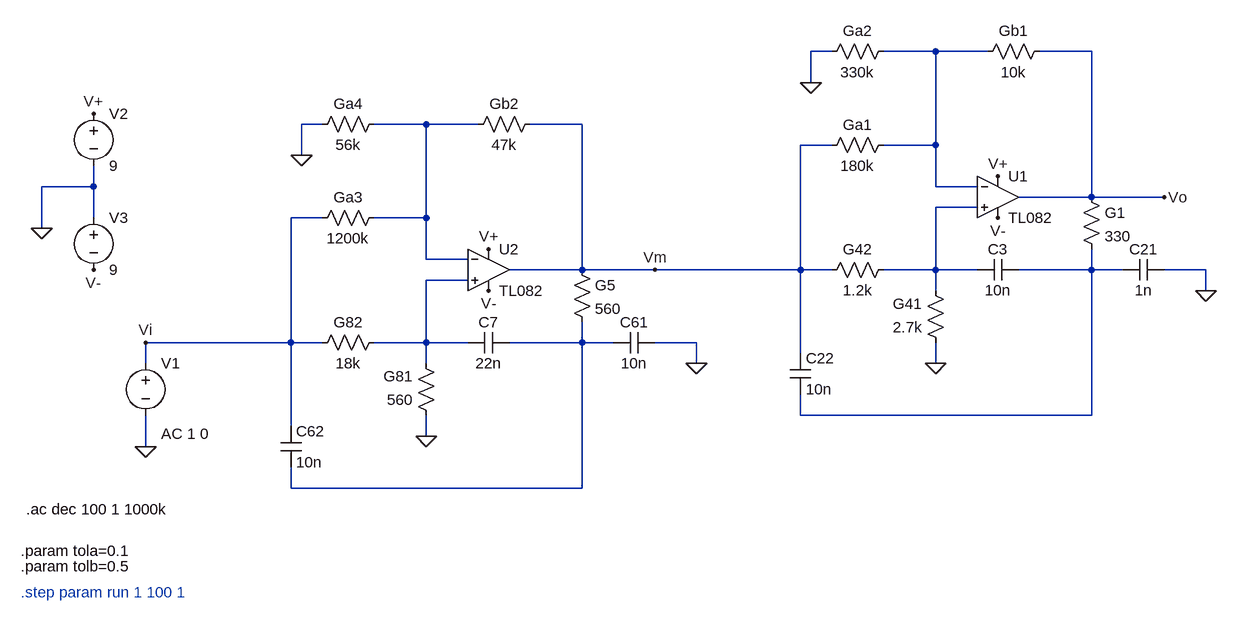
[diagram p0: schematic Sedra.asc]
Sedra.asc, the LTspice schematic file:
Version 4
SHEET 1 3604 680
WIRE 3008 -352 2976 -352
WIRE 3168 -352 3088 -352
WIRE 3248 -352 3168 -352
WIRE 3408 -352 3328 -352
WIRE 2976 -304 2976 -352
WIRE 2224 -240 2192 -240
WIRE 2384 -240 2304 -240
WIRE 2464 -240 2384 -240
WIRE 2624 -240 2544 -240
WIRE 3008 -208 2960 -208
WIRE 3168 -208 3168 -352
WIRE 3168 -208 3088 -208
WIRE 2192 -192 2192 -240
WIRE 1872 -144 1872 -176
WIRE 1872 -144 1792 -144
WIRE 3168 -144 3168 -208
WIRE 3232 -144 3168 -144
WIRE 3408 -128 3408 -352
WIRE 3408 -128 3296 -128
WIRE 3520 -128 3408 -128
WIRE 3232 -112 3168 -112
WIRE 1872 -96 1872 -144
WIRE 2224 -96 2176 -96
WIRE 2384 -96 2384 -240
WIRE 2384 -96 2304 -96
WIRE 1792 -80 1792 -144
WIRE 2384 -32 2384 -96
WIRE 2448 -32 2384 -32
WIRE 2624 -16 2624 -240
WIRE 2624 -16 2512 -16
WIRE 2736 -16 2624 -16
WIRE 2960 -16 2960 -208
WIRE 2960 -16 2736 -16
WIRE 3008 -16 2960 -16
WIRE 3168 -16 3168 -112
WIRE 3168 -16 3088 -16
WIRE 3232 -16 3168 -16
WIRE 3408 -16 3408 -48
WIRE 3408 -16 3296 -16
WIRE 3456 -16 3408 -16
WIRE 3584 -16 3520 -16
WIRE 2448 0 2384 0
WIRE 3168 16 3168 -16
WIRE 3584 16 3584 -16
WIRE 2176 96 2176 -96
WIRE 2176 96 1952 96
WIRE 2224 96 2176 96
WIRE 2384 96 2384 0
WIRE 2384 96 2304 96
WIRE 2448 96 2384 96
WIRE 2624 96 2624 64
WIRE 2624 96 2512 96
WIRE 2672 96 2624 96
WIRE 2800 96 2736 96
WIRE 2960 112 2960 -16
WIRE 1952 128 1952 96
WIRE 2384 128 2384 96
WIRE 2800 128 2800 96
WIRE 3168 128 3168 96
WIRE 2960 208 2960 176
WIRE 3408 208 3408 -16
WIRE 3408 208 2960 208
WIRE 2176 224 2176 96
WIRE 2384 240 2384 208
WIRE 1952 256 1952 208
WIRE 2176 320 2176 288
WIRE 2624 320 2624 96
WIRE 2624 320 2176 320
FLAG 2384 240 0
FLAG 2192 -192 0
FLAG 2800 128 0
FLAG 2736 -16 Vm
FLAG 2480 -48 V+
FLAG 2480 16 V-
FLAG 3168 128 0
FLAG 2976 -304 0
FLAG 3584 16 0
FLAG 1952 256 0
FLAG 1792 -80 0
FLAG 1952 96 Vi
FLAG 3520 -128 Vo
FLAG 3264 -160 V+
FLAG 1872 -256 V+
FLAG 1872 -16 V-
FLAG 3264 -96 V-
SYMBOL res 2320 80 R90
WINDOW 0 0 56 VBottom 2
WINDOW 3 32 56 VTop 2
SYMATTR InstName G82
SYMATTR Value 18k
SYMBOL res 2400 224 R180
WINDOW 0 36 76 Left 2
WINDOW 3 36 40 Left 2
SYMATTR InstName G81
SYMATTR Value 560
SYMBOL res 2208 -80 R270
WINDOW 0 32 56 VTop 2
WINDOW 3 0 56 VBottom 2
SYMATTR InstName Ga3
SYMATTR Value 1200k
SYMBOL res 2208 -224 R270
WINDOW 0 32 56 VTop 2
WINDOW 3 0 56 VBottom 2
SYMATTR InstName Ga4
SYMATTR Value 56k
SYMBOL res 2448 -224 R270
WINDOW 0 32 56 VTop 2
WINDOW 3 0 56 VBottom 2
SYMATTR InstName Gb2
SYMATTR Value 47k
SYMBOL res 2608 -32 R0
SYMATTR InstName G5
SYMATTR Value 560
SYMBOL PAULOlib\\TL082 2480 -80 R0
SYMATTR InstName U2
SYMBOL cap 2512 80 R90
WINDOW 0 0 32 VBottom 2
WINDOW 3 32 32 VTop 2
SYMATTR InstName C7
SYMATTR Value 22n
SYMBOL cap 2160 224 R0
SYMATTR InstName C62
SYMATTR Value 10n
SYMBOL cap 2736 80 R90
WINDOW 0 0 32 VBottom 2
WINDOW 3 32 32 VTop 2
SYMATTR InstName C61
SYMATTR Value 10n
SYMBOL res 3104 -32 R90
WINDOW 0 0 56 VBottom 2
WINDOW 3 32 56 VTop 2
SYMATTR InstName G42
SYMATTR Value 1.2k
SYMBOL res 3184 112 R180
WINDOW 0 36 76 Left 2
WINDOW 3 36 40 Left 2
SYMATTR InstName G41
SYMATTR Value 2.7k
SYMBOL res 2992 -192 R270
WINDOW 0 32 56 VTop 2
WINDOW 3 0 56 VBottom 2
SYMATTR InstName Ga1
SYMATTR Value 180k
SYMBOL res 2992 -336 R270
WINDOW 0 32 56 VTop 2
WINDOW 3 0 56 VBottom 2
SYMATTR InstName Ga2
SYMATTR Value 330k
SYMBOL res 3232 -336 R270
WINDOW 0 32 56 VTop 2
WINDOW 3 0 56 VBottom 2
SYMATTR InstName Gb1
SYMATTR Value 10k
SYMBOL res 3392 -144 R0
SYMATTR InstName G1
SYMATTR Value 330
SYMBOL PAULOlib\\TL082 3264 -192 R0
SYMATTR InstName U1
SYMBOL cap 3296 -32 R90
WINDOW 0 0 32 VBottom 2
WINDOW 3 32 32 VTop 2
SYMATTR InstName C3
SYMATTR Value 10n
SYMBOL cap 2944 112 R0
SYMATTR InstName C22
SYMATTR Value 10n
SYMBOL cap 3520 -32 R90
WINDOW 0 0 32 VBottom 2
WINDOW 3 32 32 VTop 2
SYMATTR InstName C21
SYMATTR Value 1n
SYMBOL voltage 1952 112 R0
WINDOW 123 24 124 Left 2
WINDOW 39 0 0 Left 0
SYMATTR Value2 AC 1 0
SYMATTR InstName V1
SYMATTR Value ""
SYMBOL voltage 1872 -272 R0
WINDOW 123 0 0 Left 0
WINDOW 39 0 0 Left 0
SYMATTR InstName V2
SYMATTR Value 9
SYMBOL voltage 1872 -112 R0
WINDOW 123 0 0 Left 0
WINDOW 39 0 0 Left 0
SYMATTR InstName V3
SYMATTR Value 9
TEXT 1760 416 Left 2 !.param tola=0.1
TEXT 1760 440 Left 2 !.param tolb=0.5
TEXT 1760 480 Left 2 ;.step param run 1 100 1
TEXT 1768 352 Left 2 !.ac dec 100 1 1000k

The netlist it stands for:
* Sedra.asc
R§G82 N005 Vi 18k
R§G81 0 N005 560
R§Ga3 Vi N002 1200k
R§Ga4 0 N002 56k
R§Gb2 N002 Vm 47k
R§G5 Vm N006 560
* U2: TL082 (symbol PAULOlib\TL082 not available, pins judged from their places): In+=N005 In-=N002 V+=V+ V-=V- OUT=Vm
C7 N006 N005 22n
C62 Vi N006 10n
C61 0 N006 10n
R§G42 N003 Vm 1.2k
R§G41 0 N003 2.7k
R§Ga1 Vm N001 180k
R§Ga2 0 N001 330k
R§Gb1 N001 Vo 10k
R§G1 Vo N004 330
* U1: TL082 (symbol PAULOlib\TL082 not available, pins judged from their places): In+=N003 In-=N001 V+=V+ V-=V- OUT=Vo
C3 N004 N003 10n
C22 Vm N004 10n
C21 0 N004 1n
V1 Vi 0 AC 1 0
V2 V+ 0 9
V3 0 V- 9
.param tola=0.1
.param tolb=0.5
* .step param run 1 100 1
.ac dec 100 1 1000k
.backanno
.end